# Altium schematic sheet Power.SchDoc
size A4
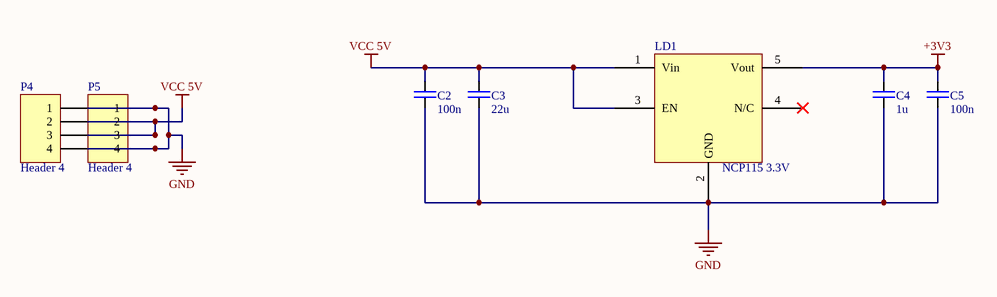
[diagram p0: Power.SchDoc]

## Parts
C2  100n  [R1005_0402i_L]
C3  22u  [C1608_0603I_L]
C4  1u  [R1005_0402i_L]
C5  100n  [R1005_0402i_L]
LD1  NCP115 3.3V  [TSOP95P280X110-6L]
P4  Header 4  [HDR1X4]
P5  Header 4  [HDR1X4]

## Nets
+3V3: C4.1 C5.1 LD1.5(Vout)
GND: C2.2 C3.2 C4.2 C5.2 LD1.2(GND) P4.1 P4.4 P5.1 P5.4
VCC 5V: C2.1 C3.1 LD1.1(Vin) LD1.3(EN) P4.2 P4.3 P5.2 P5.3

Not connected (* = marked no-connect by the designer): LD1 4(N/C)*

## Library data of the parts
C2-C5 = C: Capacitor
P4 P5 = Header 4: Header, 4-Pin; LatestRevisionDate: 17-Jul-2002; LatestRevisionNote: Re-released for DXP Platform.; Publisher: Altium Limited